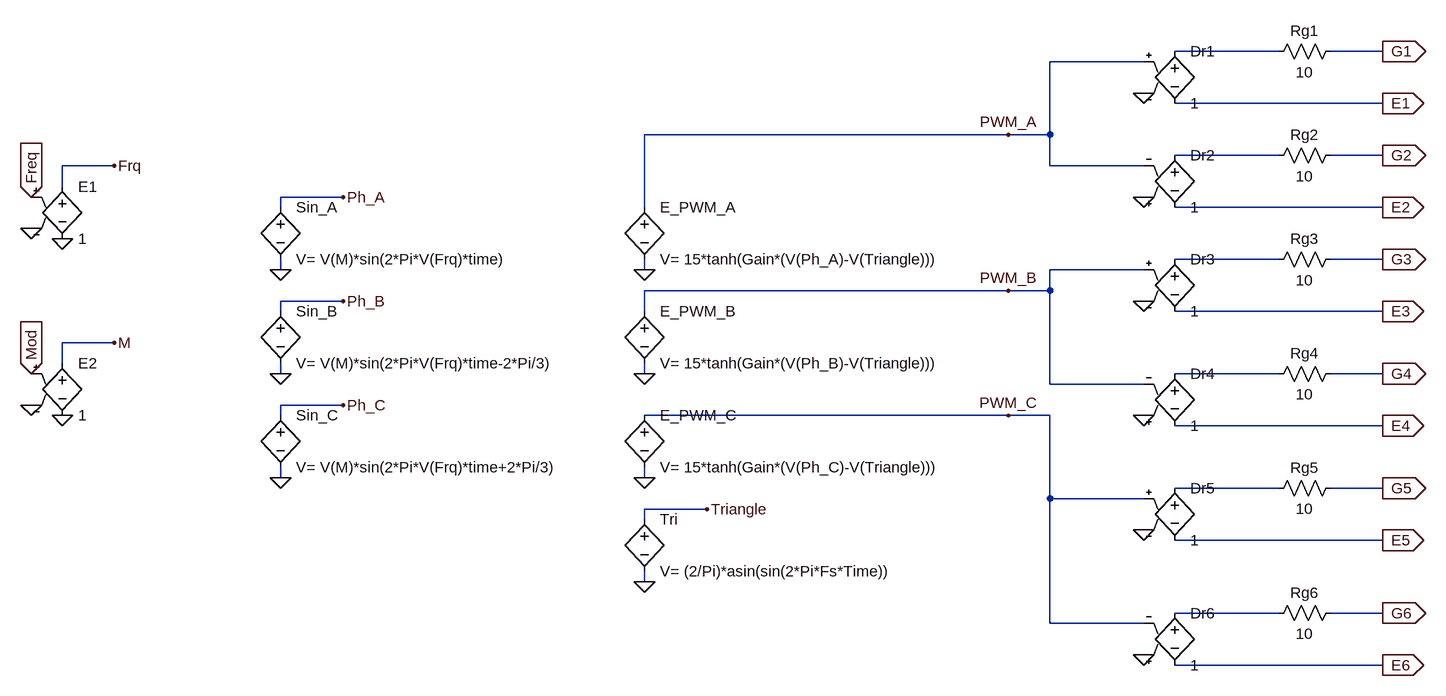
[diagram p0: schematic Trefas_exempel.asc]
Trefas_exempel.asc, the LTspice schematic file:
Version 4
SHEET 1 1756 844
WIRE 1504 -192 1344 -192
WIRE 1664 -192 1584 -192
WIRE 1296 -176 1152 -176
WIRE 1664 -112 1344 -112
WIRE 1088 -64 528 -64
WIRE 1152 -64 1152 -176
WIRE 1152 -64 1088 -64
WIRE 1504 -32 1344 -32
WIRE 1664 -32 1584 -32
WIRE -288 -16 -368 -16
WIRE 1152 -16 1152 -64
WIRE 1296 -16 1152 -16
WIRE -368 16 -368 -16
WIRE 64 32 -32 32
WIRE -32 48 -32 32
WIRE 528 48 528 -64
WIRE 1664 48 1344 48
WIRE 1504 128 1344 128
WIRE 1664 128 1584 128
WIRE -32 144 -32 128
WIRE 528 144 528 128
WIRE 1296 144 1152 144
WIRE 1088 176 528 176
WIRE 1152 176 1152 144
WIRE 1152 176 1088 176
WIRE 64 192 -32 192
WIRE -32 208 -32 192
WIRE 528 208 528 176
WIRE 1664 208 1344 208
WIRE -288 256 -368 256
WIRE -368 288 -368 256
WIRE -32 304 -32 288
WIRE 528 304 528 288
WIRE 1504 304 1344 304
WIRE 1664 304 1584 304
WIRE 1152 320 1152 176
WIRE 1296 320 1152 320
WIRE 64 352 -32 352
WIRE -32 368 -32 352
WIRE 1088 368 528 368
WIRE 1152 368 1088 368
WIRE 1664 384 1344 384
WIRE -32 464 -32 448
WIRE 528 464 528 448
WIRE 1504 480 1344 480
WIRE 1664 480 1584 480
WIRE 1152 496 1152 368
WIRE 1296 496 1152 496
WIRE 624 512 528 512
WIRE 528 528 528 512
WIRE 1664 560 1344 560
WIRE 528 624 528 608
WIRE 1504 672 1344 672
WIRE 1664 672 1584 672
WIRE 1152 688 1152 496
WIRE 1296 688 1152 688
WIRE 1664 752 1344 752
FLAG -32 144 0
FLAG -32 304 0
FLAG -32 464 0
FLAG 528 144 0
FLAG 528 304 0
FLAG 528 464 0
FLAG 528 624 0
FLAG 64 32 Ph_A
FLAG 64 192 Ph_B
FLAG 64 352 Ph_C
FLAG 624 512 Triangle
FLAG 1296 -128 0
FLAG 1296 32 0
FLAG 1296 192 0
FLAG 1296 368 0
FLAG 1296 544 0
FLAG 1296 736 0
FLAG 1088 -64 PWM_A
FLAG 1088 176 PWM_B
FLAG 1088 368 PWM_C
FLAG 1664 -192 G1
IOPIN 1664 -192 Out
FLAG 1664 -112 E1
IOPIN 1664 -112 Out
FLAG 1664 -32 G2
IOPIN 1664 -32 Out
FLAG 1664 48 E2
IOPIN 1664 48 Out
FLAG 1664 128 G3
IOPIN 1664 128 Out
FLAG 1664 208 E3
IOPIN 1664 208 Out
FLAG 1664 304 G4
IOPIN 1664 304 Out
FLAG 1664 384 E4
IOPIN 1664 384 Out
FLAG 1664 480 G5
IOPIN 1664 480 Out
FLAG 1664 560 E5
IOPIN 1664 560 Out
FLAG 1664 672 G6
IOPIN 1664 672 Out
FLAG 1664 752 E6
IOPIN 1664 752 Out
FLAG -416 32 Freq
IOPIN -416 32 In
FLAG -416 304 Mod
IOPIN -416 304 In
FLAG -368 96 0
FLAG -416 80 0
FLAG -416 352 0
FLAG -368 368 0
FLAG -288 -16 Frq
FLAG -288 256 M
SYMBOL bv -32 32 R0
SYMATTR InstName Sin_A
SYMATTR Value V= V(M)*sin(2*Pi*V(Frq)*time)
SYMBOL bv -32 192 R0
SYMATTR InstName Sin_B
SYMATTR Value V= V(M)*sin(2*Pi*V(Frq)*time-2*Pi/3)
SYMBOL bv -32 352 R0
SYMATTR InstName Sin_C
SYMATTR Value V= V(M)*sin(2*Pi*V(Frq)*time+2*Pi/3)
SYMBOL bv 528 32 R0
SYMATTR InstName E_PWM_A
SYMATTR Value V= 15*tanh(Gain*(V(Ph_A)-V(Triangle)))
SYMBOL bv 528 192 R0
SYMATTR InstName E_PWM_B
SYMATTR Value V= 15*tanh(Gain*(V(Ph_B)-V(Triangle)))
SYMBOL bv 528 352 R0
SYMATTR InstName E_PWM_C
SYMATTR Value V= 15*tanh(Gain*(V(Ph_C)-V(Triangle)))
SYMBOL bv 528 512 R0
SYMATTR InstName Tri
SYMATTR Value V= (2/Pi)*asin(sin(2*Pi*Fs*Time))
SYMBOL e 1344 -208 R0
SYMATTR InstName Dr1
SYMATTR Value 1
SYMBOL e 1344 112 R0
SYMATTR InstName Dr3
SYMATTR Value 1
SYMBOL e 1344 464 R0
SYMATTR InstName Dr5
SYMATTR Value 1
SYMBOL e2 1344 -48 R0
SYMATTR InstName Dr2
SYMATTR Value 1
SYMBOL e2 1344 288 R0
SYMATTR InstName Dr4
SYMATTR Value 1
SYMBOL e2 1344 656 R0
SYMATTR InstName Dr6
SYMATTR Value 1
SYMBOL res 1488 -176 R270
WINDOW 0 32 56 VTop 2
WINDOW 3 0 56 VBottom 2
SYMATTR InstName Rg1
SYMATTR Value 10
SYMBOL res 1488 -16 R270
WINDOW 0 32 56 VTop 2
WINDOW 3 0 56 VBottom 2
SYMATTR InstName Rg2
SYMATTR Value 10
SYMBOL res 1488 144 R270
WINDOW 0 32 56 VTop 2
WINDOW 3 0 56 VBottom 2
SYMATTR InstName Rg3
SYMATTR Value 10
SYMBOL res 1488 320 R270
WINDOW 0 32 56 VTop 2
WINDOW 3 0 56 VBottom 2
SYMATTR InstName Rg4
SYMATTR Value 10
SYMBOL res 1488 496 R270
WINDOW 0 32 56 VTop 2
WINDOW 3 0 56 VBottom 2
SYMATTR InstName Rg5
SYMATTR Value 10
SYMBOL res 1488 688 R270
WINDOW 0 32 56 VTop 2
WINDOW 3 0 56 VBottom 2
SYMATTR InstName Rg6
SYMATTR Value 10
SYMBOL e -368 0 R0
SYMATTR InstName E1
SYMATTR Value 1
SYMBOL e -368 272 R0
SYMATTR InstName E2
SYMATTR Value 1

The netlist it stands for:
* Trefas_exempel.asc
B§Sin_A Ph_A 0 V= V(M)*sin(2*Pi*V(Frq)*time)
B§Sin_B Ph_B 0 V= V(M)*sin(2*Pi*V(Frq)*time-2*Pi/3)
B§Sin_C Ph_C 0 V= V(M)*sin(2*Pi*V(Frq)*time+2*Pi/3)
B§E_PWM_A PWM_A 0 V= 15*tanh(Gain*(V(Ph_A)-V(Triangle)))
B§E_PWM_B PWM_B 0 V= 15*tanh(Gain*(V(Ph_B)-V(Triangle)))
B§E_PWM_C PWM_C 0 V= 15*tanh(Gain*(V(Ph_C)-V(Triangle)))
B§Tri Triangle 0 V= (2/Pi)*asin(sin(2*Pi*Fs*Time))
E§Dr1 N001 E1 PWM_A 0 1
E§Dr3 N003 E3 PWM_B 0 1
E§Dr5 N005 E5 PWM_C 0 1
E§Dr2 N002 E2 0 PWM_A 1
E§Dr4 N004 E4 0 PWM_B 1
E§Dr6 N006 E6 0 PWM_C 1
Rg1 N001 G1 10
Rg2 N002 G2 10
Rg3 N003 G3 10
Rg4 N004 G4 10
Rg5 N005 G5 10
Rg6 N006 G6 10
E1 Frq 0 Freq 0 1
E2 M 0 Mod 0 1
.backanno
.end